# EasyEDA Pro project 雏鹰板1.eprj

# Schematic Schematic1
Board Name: Board1; Create Date: 2024-09-22; Page Name: P1; Project Name: 雏鹰板; Schematic Name: Schematic1; Update Date: 2024-09-23; Company: 嘉立创EDA; Page Size: A4; Version: V1.0
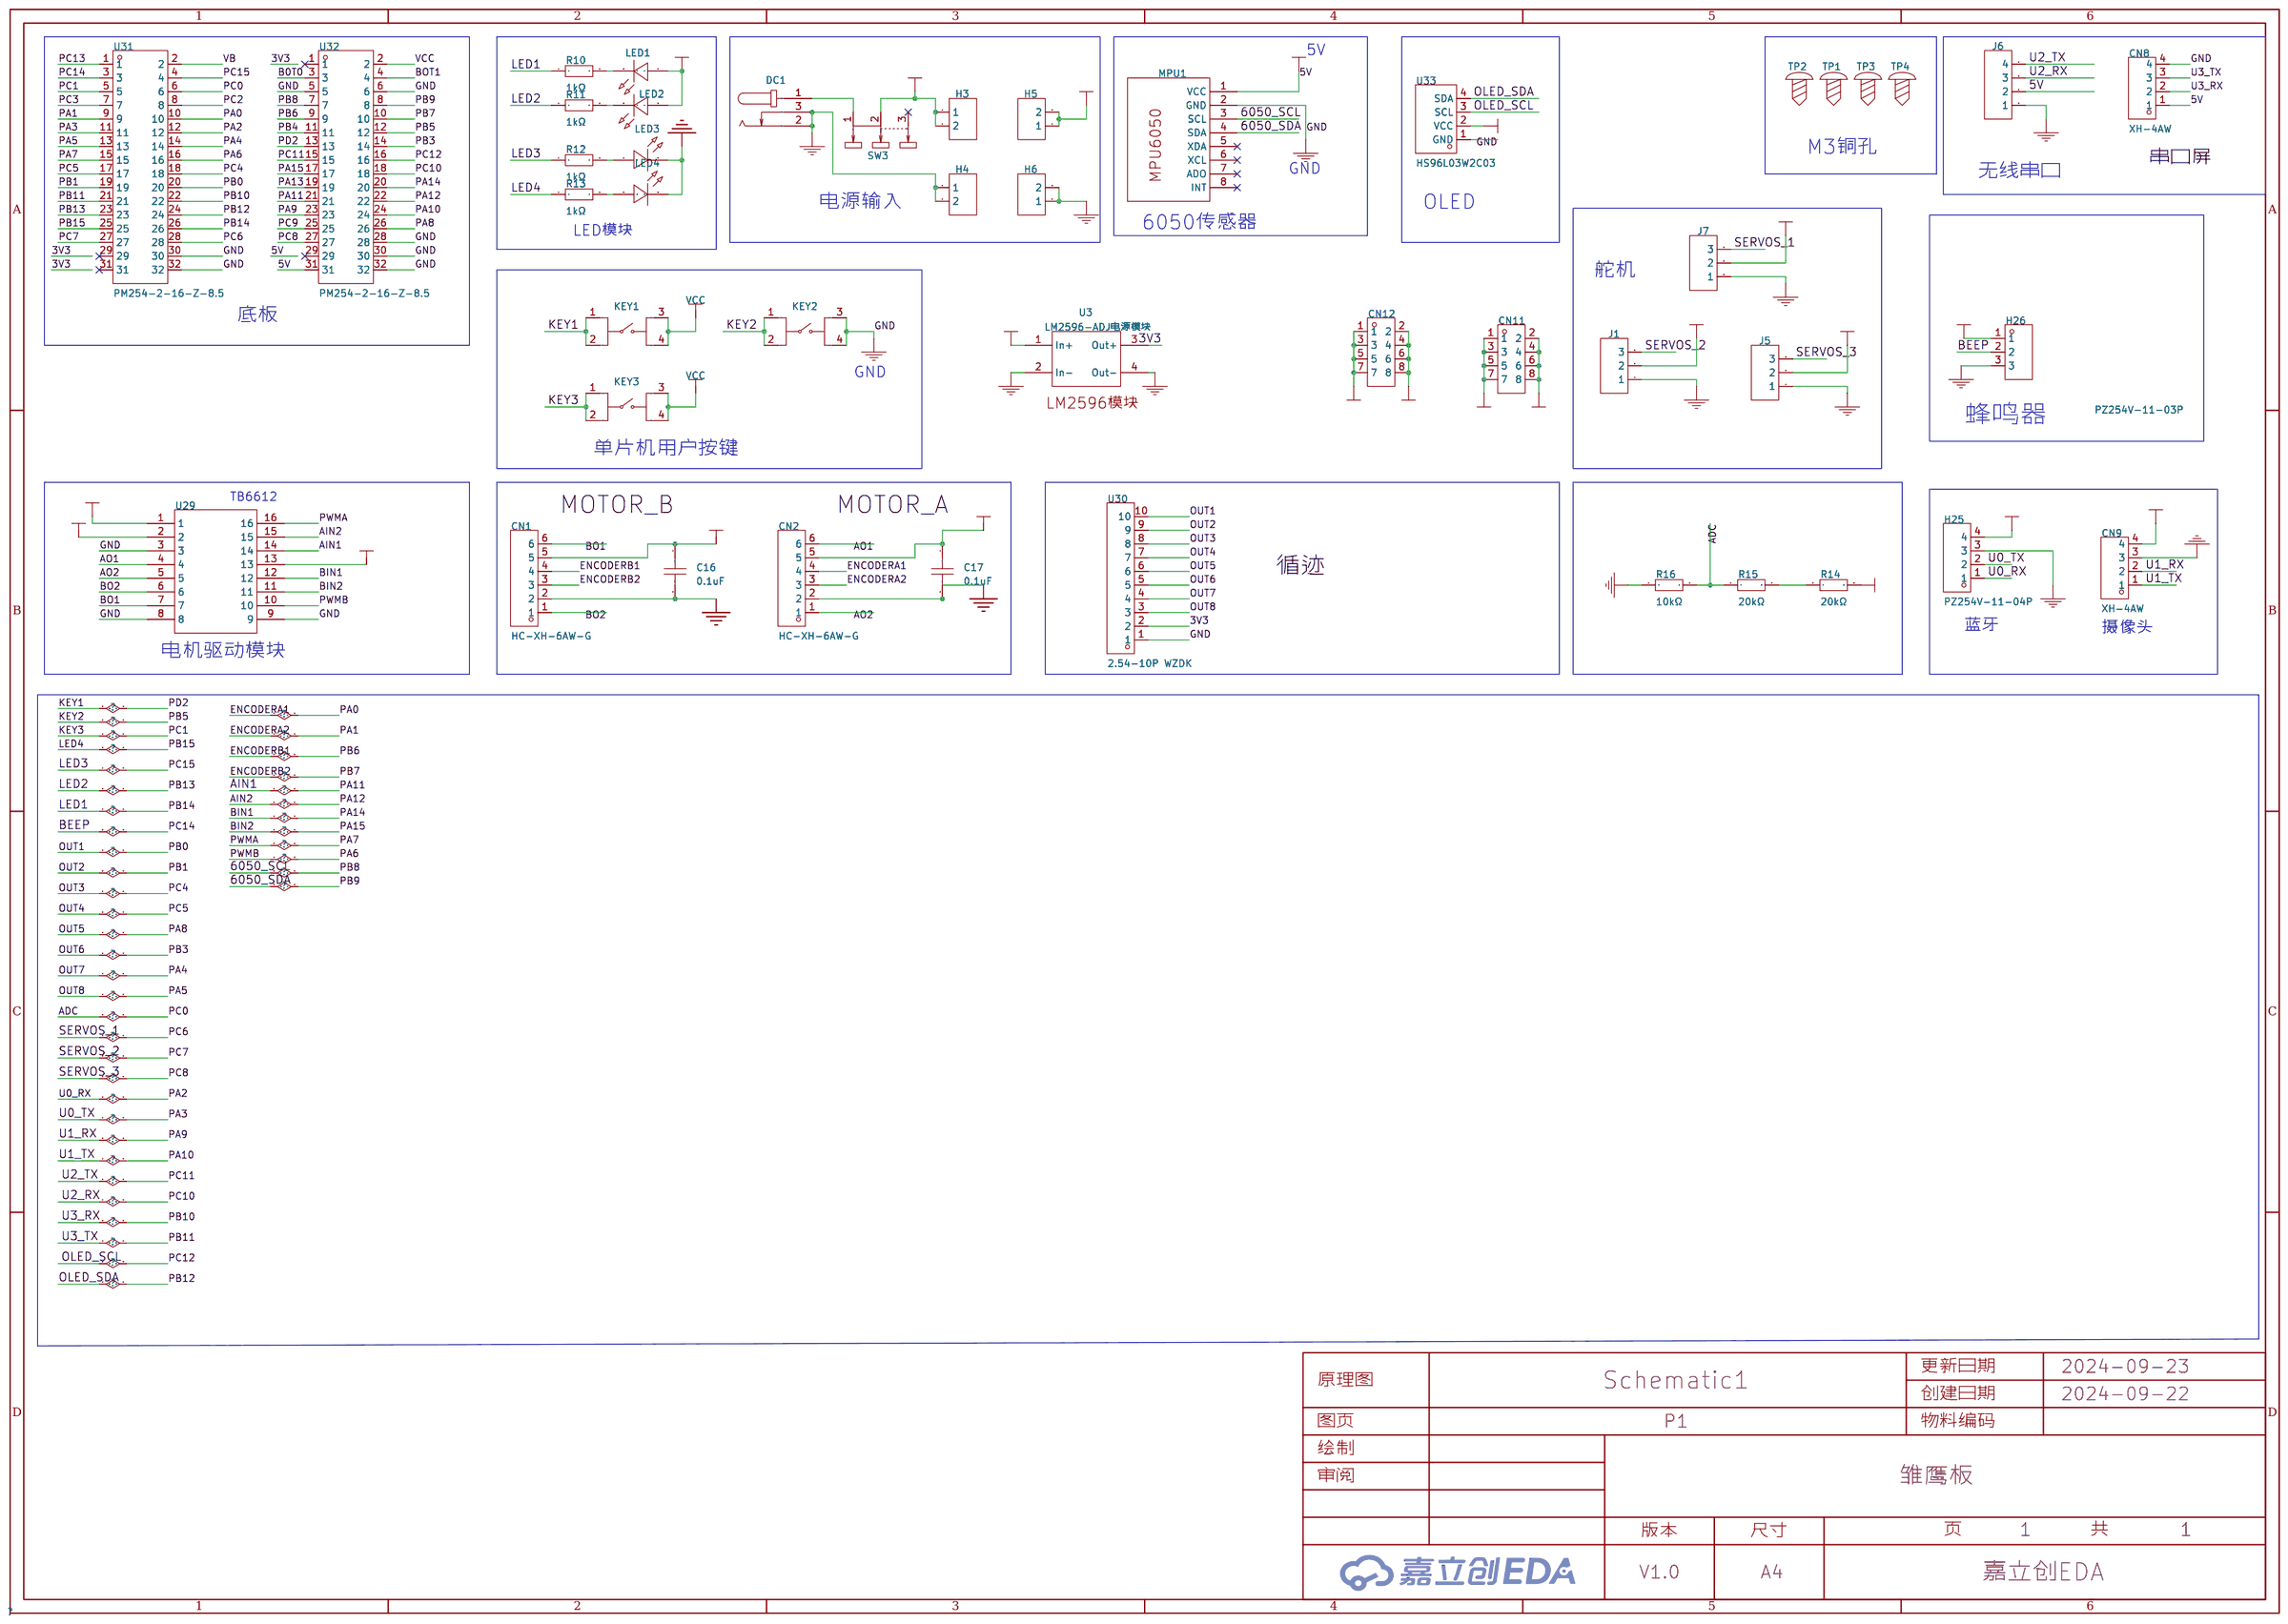
[diagram p0: schematic sheet]

## Parts
C16  0.1uF  [C0603]
C17  0.1uF  [C0603]
CN1  HC-XH-6AW-G  [CONN-TH_6P-P2.50_HC-XH-6AW-G]
CN2  HC-XH-6AW-G  [CONN-TH_6P-P2.50_HC-XH-6AW-G]
CN8  XH-4AW  [CONN-TH_XH-4AW]
CN9  XH-4AW  [CONN-TH_XH-4AW]
CN11  HC-PZ254-11.5L-2x4PZ  [HDR-TH_8P-P2.54-V-M-R2-C4-S2.54]
CN12  HC-PZ254-11.5L-2x4PZ  [HDR-TH_8P-P2.54-V-M-R2-C4-S2.54]
DC1  DC005_C431533  [DC-IN-TH_DC005]
H3  HDR-F-2.54_1x2  [HDR-F-2.54_1X2]
H4  HDR-F-2.54_1x2  [HDR-F-2.54_1X2]
H5  HDR-F-2.54_1x2  [HDR-F-2.54_1X2]
H6  HDR-F-2.54_1x2  [HDR-F-2.54_1X2]
H25  PZ254V-11-04P  [HDR-TH_4P-P2.54-V-M]
H26  PZ254V-11-03P  [HDR-TH_3P-P2.54-V-M]
J1  HDR-M-2.54_1x3  [HDR-M-2.54_1X3]
J5  HDR-M-2.54_1x3  [HDR-M-2.54_1X3]
J6  HDR-M-2.54_1x4  [HDR-M-2.54_1X4]
J7  HDR-M-2.54_1x3  [HDR-M-2.54_1X3]
KEY1  K2-6639SP-C4SC-04  [KEY-SMD_4P-L6.0-W6.0-P3.90-LS10.0]
KEY2  K2-6639SP-C4SC-04  [KEY-SMD_4P-L6.0-W6.0-P3.90-LS10.0]
KEY3  K2-6639SP-C4SC-04  [KEY-SMD_4P-L6.0-W6.0-P3.90-LS10.0]
LED1  LED-TH-5mm_R  [LED-TH_BD5.0_RED]
LED2  LED-TH-5mm_R  [LED-TH_BD5.0_RED]
LED3  LED-TH-5mm_R  [LED-TH_BD5.0_RED]
LED4  LED-TH-5mm_R  [LED-TH_BD5.0_RED]
MPU1  MPU6050 有孔(锁定丝印)  [MPU6050-丝印不可移]
R10  1kΩ  [R0603]
R11  1kΩ  [R0603]
R12  1kΩ  [R0603]
R13  1kΩ  [R0603]
R14  20kΩ  [R0805]
R15  20kΩ  [R0805]
R16  10kΩ  [R0805]
SW3  SS-12D10L5  [SW-TH_SS-12D10L5]
TP1  M3铜柱带丝印  [M3铜柱]
TP2  M3铜柱带丝印  [M3铜柱]
TP3  M3铜柱带丝印  [M3铜柱]
TP4  M3铜柱带丝印  [M3铜柱]
U3  LM2596-ADJ电源模块  [LM2596-ADJ模块]
U29  -  [COMM-TH_TB6612]
U30  2.54-10P WZDK  [HDR-TH_10P-P2.50-H-F-W7.0-N]
U31  PM254-2-16-Z-8.5  [HDR-TH_32P-P2.54-V-F-R2-C16-S2.54]
U32  PM254-2-16-Z-8.5  [HDR-TH_32P-P2.54-V-F-R2-C16-S2.54]
U33  HS96L03W2C03  [OLED-TH_L27.8-W27.2-P2.54_C9900033791]

## Library data of the parts
C16 C17 = CGA0603X5R106M350JT: 容值:10uF;精度:±20%;额定电压:35V;材质(温度系数):X5R;; LCSC Part Name: 10uF ±20% 35V; Supplier Part: C6119878; Manufacturer: HRE(芯声); Supplier Footprint: 0603; Supplier: LCSC; Tolerance: ±20%; Voltage Rated: 35V; Temperature Coefficient: X5R
CN1 CN2 = HC-XH-6AW-G: 插针结构:1x6P;间距:2.5mm;安装方式:弯插;参考系列:XH;总PIN数:6P;排数:1;每排PIN数:6;行距:-;额定电流:3A;触头材质:黄铜;触头镀层:锡;工作温度范围:-25℃~+85℃;; LCSC Part Name: 1x6P 间距:2.5mm 弯插 系列:XH; Supplier Part: C5341212; Manufacturer: HCTL(华灿天禄); Supplier Footprint: 弯插,P=2.5mm; JLCPCB Part Class: 扩展库; Datasheet: https://atta.szlcsc.com/upload/public/pdf/source/20230711/B565BAF3B11666EF6B81B3605408F2BD.pdf; Supplier: LCSC; Pins Structure: 1x6P; Pitch: 2.5mm; Mounting Style: 弯插; Reference Series: XH; Number of Pins: 6P; Number of Rows: 1; Number of PINs Per Row: 6; Current Rating (Max): 3A; Contact Material: 黄铜; Contact Plating: 锡; Operating Temperature Range: -25℃~+85℃
CN8 CN9 = XH-4AW: 插针结构:1x4P;间距:2.54mm;安装方式:弯插;参考系列:XH;总PIN数:4P;排数:1;每排PIN数:4;行距:-;额定电流:3A;触头材质:黄铜;触头镀层:锡;工作温度范围:-25℃~+85℃;; LCSC Part Name: 1x4P 间距:2.54mm 弯插 系列:XH; Supplier Part: C2908613; Manufacturer: HCTL(华灿天禄); Supplier Footprint: 弯插,P=2.5mm; JLCPCB Part Class: 扩展库; Datasheet: https://atta.szlcsc.com/upload/public/pdf/source/20230711/B565BAF3B11666EF6B81B3605408F2BD.pdf; Supplier: LCSC; Pins Structure: 1x4P; Pitch: 2.54mm; Mounting Style: 弯插; Reference Series: XH; Number of Pins: 4P; Number of Rows: 1; Number of PINs Per Row: 4; Current Rating (Max): 3A; Contact Material: 黄铜; Contact Plating: 锡; Operating Temperature Range: -25℃~+85℃
CN11 CN12 = HC-PZ254-11.5L-2x4PZ: 插针结构：2x4P间距：2.54mm行距：2.54mm圆针/方针:方针安装类型:直插排数:双排总PIN位数:8P额定电流:3A额定电压:1000V配合针长度:6mm塑高:2.5mm端接针长度:3mm触头材质:黄铜触头镀层:金工作温度范围:-40℃~+105℃焊接温度(最大值):260℃@5s颜色:黑色; LCSC Part Name: 间距2.54mm 2x4Pin 直插 H2.5 L11.5; Supplier Part: C27985200; Manufacturer: HC(虹成电子); Supplier Footprint: 插件,P=2.54mm; Datasheet: https://atta.szlcsc.com/upload/public/pdf/source/20240710/7243C4D67459C8BB080740A4C04FBFB8.pdf; Supplier: LCSC
DC1 = DC005_C431533: Supplier: LCSC; Supplier Part: C431533; Manufacturer: SHOU HAN; Manufacturer Part: DC005; JLCPCB Part Class: Extended Part
H3-H6 = HDR-F-2.54_1x2: Supplier Part: C49661; Supplier: LCSC
H25 = PZ254V-11-04P: 插针结构:1x4P;间距:2.54mm;行距:-;圆针/方针:方针;安装类型:直插;排数:单排;总PIN位数:4P;额定电流:3A;额定电压:250V;配合针长度:6mm;塑高:2.5mm;端接针长度:3mm;触头材质:-;工作温度范围:-40℃~+105℃;颜色:黑色;; LCSC Part Name: 间距:2.54mm 1x4P 直插 方针; Supplier Part: C2691448; Manufacturer: XFCN(兴飞); Supplier Footprint: 插件,P=2.54mm; JLCPCB Part Class: 扩展库; Datasheet: https://atta.szlcsc.com/upload/public/pdf/source/20200309/C492403_F9F19131791D08044AD4F84F8E751A34.pdf; Supplier: LCSC; Pin Structure: 1x4P; Pitch: 2.54mm; Circluar Pins/Square Pins: 方针; Mounting Type: 直插; Number of Rows: 单排; Number of Pins: 4P; Current Rating (Max): 3A; Voltage Rating (Max): 250V; Length of Mating Pin: 6mm; Insulation Height: 2.5mm; Length of End Connection Pin: 3mm; Operating Temperature Range: -40℃~+105℃; Color: 黑色
H26 = PZ254V-11-03P: 插针结构:1x3P;间距:2.54mm;行距:-;圆针/方针:方针;安装类型:直插;排数:单排;总PIN位数:3P;额定电流:3A;额定电压:250V;配合针长度:6mm;塑高:2.5mm;端接针长度:3mm;工作温度范围:-40℃~+105℃;颜色:黑色;; LCSC Part Name: 间距:2.54mm 1x3P 直插 方针; Supplier Part: C2937625; Manufacturer: XFCN(兴飞); Supplier Footprint: 插件,P=2.54mm; JLCPCB Part Class: 扩展库; Datasheet: https://atta.szlcsc.com/upload/public/pdf/source/20200309/C492402_8335C3D49C4E4C618838D59BB1D024C1.pdf; Supplier: LCSC; Pin Structure: 1x3P; Pitch: 2.54mm; Circluar Pins/Square Pins: 方针; Mounting Type: 直插; Number of Rows: 单排; Number of Pins: 3P; Current Rating (Max): 3A; Voltage Rating (Max): 250V; Length of Mating Pin: 6mm; Insulation Height: 2.5mm; Length of End Connection Pin: 3mm; Operating Temperature Range: -40℃~+105℃; Color: 黑色
J1 J5 J7 = HDR-M-2.54_1x3: Supplier Part: C180248; Supplier: LCSC
J6 = HDR-M-2.54_1x4: Supplier Part: C124378; Supplier: LCSC
KEY1-KEY3 = K2-6639SP-C4SC-04: Supplier: LCSC; Manufacturer: HRO; Supplier Part: C83206; JLCPCB Part Class: Extended Part
LED1-LED4 = LED-TH-5mm_R: Manufacturer: EVERLIGHT(台湾亿光); Manufacturer Part: 333-2SURD/S530-A3; Supplier Part: C87271; Supplier: LCSC
MPU1 = MPU6050 有孔(锁定丝印)
R10-R13 = RC0603FR-071KL: 电阻类型:厚膜电阻;阻值:1kΩ;精度:±1%;功率:100mW;最大工作电压:75V;温度系数:±100ppm/℃;; LCSC Part Name: 厚膜电阻 1kΩ ±1% 100mW; Supplier Part: C22548; Manufacturer: YAGEO(国巨); Supplier Footprint: 0603; JLCPCB Part Class: 扩展库; Datasheet: https://atta.szlcsc.com/upload/public/pdf/source/20180316/70C0E2BDAE7FCC62C531A5A58D202EE1.pdf; Supplier: LCSC; Type: 厚膜电阻; Tolerance: ±1%; Power(Watts): 100mW; Overload Voltage (Max): 75V; Temperature Coefficient: ±100ppm/℃; Operating Temperature Range: -55℃~+155℃
R14 R15 = RC0805JR-0720KL: 电阻类型:厚膜电阻;阻值:20kΩ;精度:±5%;功率:125mW;最大工作电压:150V;温度系数:±100ppm/℃;; LCSC Part Name: 厚膜电阻 20kΩ ±5% 125mW; Supplier Part: C114233; Manufacturer: YAGEO(国巨); Supplier Footprint: 0805; JLCPCB Part Class: 扩展库; Datasheet: https://atta.szlcsc.com/upload/public/pdf/source/20170705/1499242704799.pdf; Supplier: LCSC; Type: 厚膜电阻; Tolerance: ±5%; Power(Watts): 125mW; Overload Voltage (Max): 150V; Temperature Coefficient: ±100ppm/℃; Operating Temperature Range: -55℃~+155℃
R16 = RT0805BRD0710KL: 电阻类型:薄膜电阻;阻值:10kΩ;精度:±0.1%;功率:125mW;最大工作电压:150V;温度系数:±25ppm/℃;; LCSC Part Name: 薄膜电阻 10kΩ ±0.1% 125mW; Supplier Part: C110775; Manufacturer: YAGEO(国巨); Supplier Footprint: 0805; JLCPCB Part Class: 扩展库; Datasheet: https://atta.szlcsc.com/upload/public/pdf/source/20171026/C133380_15089840010201058857.pdf; Supplier: LCSC; Type: 薄膜电阻; Tolerance: ±0.1%; Power(Watts): 125mW; Overload Voltage (Max): 150V; Temperature Coefficient: ±25ppm/℃; Operating Temperature Range: -55℃~+155℃
SW3 = SS-12D10L5: Supplier: LCSC; Supplier Part: C319012; Manufacturer: XKB Enterprise; JLCPCB Part Class: Extended Part
TP1-TP4 = M3铜柱带丝印
U3 = LM2596-ADJ电源模块
U29 = TB6612引脚插入型器件
U30 = 2.54-10P WZDK: 插针结构:1x10P;间距:2.5mm;安装方式:弯插;参考系列:XH;总PIN数:10P;排数:1;每排PIN数:10;额定电流:3A;触头材质:黄铜;触头镀层:锡;工作温度范围:-25℃~+85℃;; LCSC Part Name: 1x10P 间距:2.5mm 弯插 系列:XH 白色; Supplier Part: C18185679; Manufacturer: SHOU HAN(首韩); Supplier Footprint: 弯插,P=2.5mm; JLCPCB Part Class: 扩展库; Datasheet: https://atta.szlcsc.com/upload/public/pdf/source/20230919/4BD47710B65E65967C81E321361D4DDB.pdf; Supplier: LCSC; Pins Structure: 1x10P; Pitch: 2.5mm; Mounting Style: 弯插; Reference Series: XH; Number of Pins: 10P; Number of Rows: 1; Number of PINs Per Row: 10; Current Rating (Max): 3A; Contact Material: 黄铜; Contact Plating: 锡; Operating Temperature Range: -25℃~+85℃
U31 U32 = PM254-2-16-Z-8.5: 插孔结构:2x16P;间距:2.54mm;行距:2.54mm;圆孔/方孔:方孔;安装类型:直插;排数:双排;总孔位数:32P;额定电流:3A;额定电压:-;插孔方向:顶部;塑高:8.5mm;触头材质:铜合金;工作温度范围:-40℃~+105℃;焊接温度(最大值):260℃@5S;; LCSC Part Name: 2x16P 间距:2.54mm 直插; Supplier Part: C2897417; Manufacturer: HCTL(华灿天禄); Supplier Footprint: 插件,P=2.54mm; JLCPCB Part Class: 扩展库; Datasheet: https://atta.szlcsc.com/upload/public/pdf/source/20230609/3D36CA2C1BFC9FD1C3F709AD9DFEB9C2.pdf; Supplier: LCSC; Holes Structure: 2x16P; Pitch: 2.54mm; Row Spacing: 2.54mm; Circular Hole / Square Hole: 方孔; Mounting Type: 直插; Number of Rows: 双排; Number of Holes: 32P; Current Rating (Max): 3A; Holes Direction: 顶部; Insulation Height: 8.5mm; Contact Material: 铜合金; Operating Temperature Range: -40℃~+105℃; Soldering Temperature(Max): 260℃@5S
U33 = HS96L03W2C03: 主控芯片:SSD1315;接口类型:I2C;尺寸(inch):0.96;像素分辨率:128x64;; LCSC Part Name: 0.96寸OLED显示屏窄白光IIC; Supplier Part: C5248080; Manufacturer: HS(汉昇); JLCPCB Part Class: 扩展库; Datasheet: https://atta.szlcsc.com/upload/public/pdf/source/20230627/763D01F79A90007632F098068C7C8AD9.pdf; Supplier: LCSC; Main Control Chip: SSD1315; Interface Type: I2C; Size: 0.96; Pixel Resolution: 128x64; Operating Temperature: -40℃~+70℃

## Nets
3V3: CN12.1 CN12.3 CN12.5 CN12.7 J1.2 J5.2 J7.2 LED1.1 LED2.1 U3.3(Out+) U30.2
5V: C16.1 C17.1 CN1.5 CN2.5 CN8.1 CN9.4 CN11.1 CN11.3 CN11.5 CN11.7 H5.1 H5.2 H25.4 H26.1 J6.2 MPU1.1(VCC) U29.2 U29.13 U32.31 U33.2(VCC)
GND: C16.2 C17.2 CN1.2 CN2.2 CN8.4 CN9.3 CN12.2 CN12.4 CN12.6 CN12.8 DC1.2 DC1.3 H4.1 H4.2 H6.1 H6.2 H25.3 H26.3 J1.1 J5.1 J6.1 J7.1 KEY2.3 KEY2.4 LED3.2 LED4.2 MPU1.2(GND) R16.1 U3.2(In-) U3.4(Out-) U29.3 U29.8 U29.9 U30.1 U31.30 U31.32 U32.5 U32.6 U32.28 U32.30 U32.32 U33.1(GND)
VBAT_IN: CN11.2 CN11.4 CN11.6 CN11.8 H3.1 H3.2 R14.2 SW3.2 U3.1(In+) U29.1
VCC: KEY1.3 KEY1.4 KEY3.3 KEY3.4 U32.2
6050_SCL: MPU1.3(SCL) U32.7
6050_SDA: MPU1.4(SDA) U32.8
ADC: R15.1 R16.2 U31.6
AIN1: U29.14 U32.21
AIN2: U29.15 U32.22
AO1: CN2.6 U29.4
AO2: CN2.1 U29.5
B0T0: U32.3
BEEP: H26.2 U31.3
BIN1: U29.12 U32.20
BIN2: U29.11 U32.17
BO1: CN1.6 U29.7
BO2: CN1.1 U29.6
BOT1: U32.4
ENCODERA1: CN2.4 U31.10
ENCODERA2: CN2.3 U31.9
ENCODERB1: CN1.4 U32.9
ENCODERB2: CN1.3 U32.10
KEY1: KEY1.1 KEY1.2 U32.13
KEY2: KEY2.1 KEY2.2 U32.12
KEY3: KEY3.1 KEY3.2 U31.5
LED1: R10.1 U31.26
LED2: R11.1 U31.23
LED3: R12.1 U31.4
LED4: R13.1 U31.25
OLED_SCL: U32.16 U33.3(SCL)
OLED_SDA: U31.24 U33.4(SDA)
OUT1: U30.10 U31.20
OUT2: U30.9 U31.19
OUT3: U30.8 U31.18
OUT4: U30.7 U31.17
OUT5: U30.6 U32.26
OUT6: U30.5 U32.14
OUT7: U30.4 U31.14
OUT8: U30.3 U31.13
PA2: H25.1 U31.12
PA3: H25.2 U31.11
PA6: U29.10 U31.16
PA7: U29.16 U31.15
PA9: CN9.2 U32.23
PA10: CN9.1 U32.24
PA13: U32.19
PB4: U32.11
PB10: CN8.2 U31.22
PB11: CN8.3 U31.21
PC2: U31.8
PC3: U31.7
PC6: J7.3 U31.28
PC7: J1.3 U31.27
PC8: J5.3 U32.27
PC9: U32.25
PC10: J6.3 U32.18
PC11: J6.4 U32.15
PC13: U31.1
VB: U31.2
$1N2595: LED2.2 R11.2
$1N2596: LED1.2 R10.2
$1N2601: LED3.1 R12.2
$1N2602: LED4.1 R13.2
$1N3090: DC1.1 SW3.1
$1N6234: R14.1 R15.2

Not connected (* = marked no-connect by the designer): MPU1 5(XDA)* 6(XCL)* 7(ADO)* 8(INT)*; SW3 3*; U31 29* 31*; U32 1* 29*

## Notes on the sheet
- 5V
- M3铜孔
- GND
- 串口屏
- 无线串口
- 电源输入
- OLED
- LED模块
- 6050传感器
- 舵机
- 底板
- GND
- 蜂鸣器
- 单片机用户按键
- TB6612
- MOTOR_B
- MOTOR_A
- 循迹
- 蓝牙
- 摄像头
- 电机驱动模块

# Board PCB1
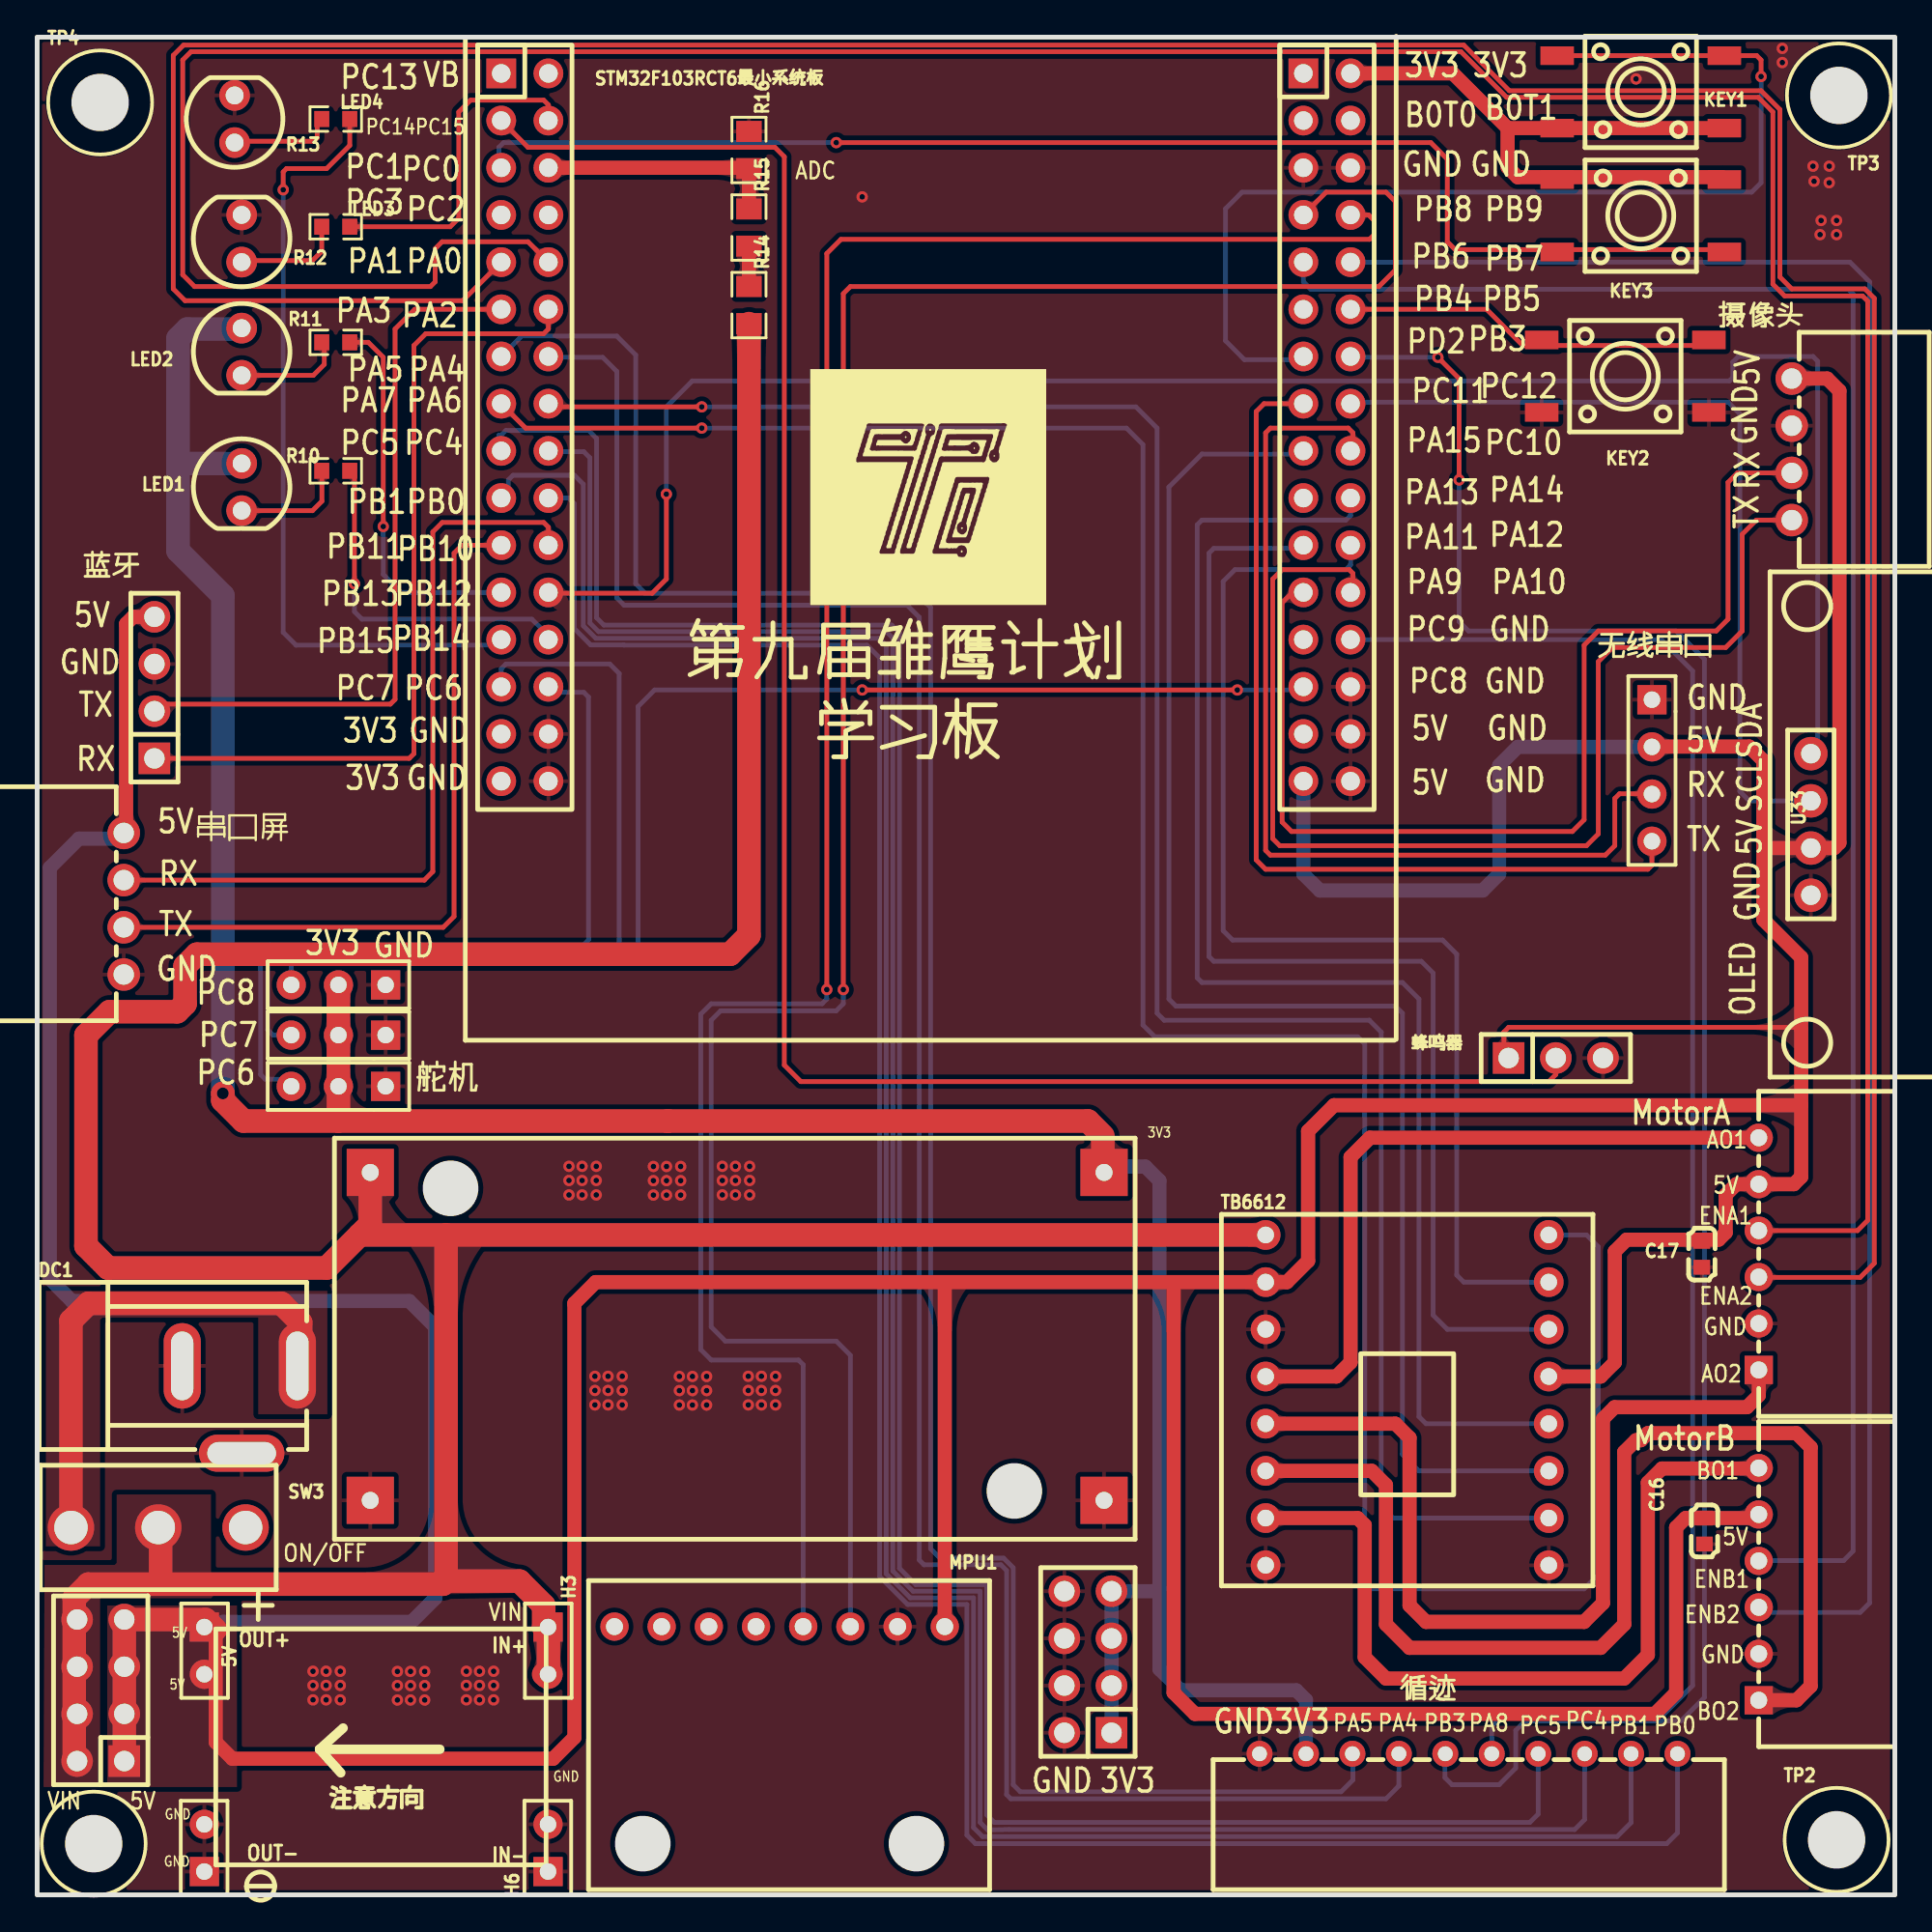
[diagram p1: board, top side]
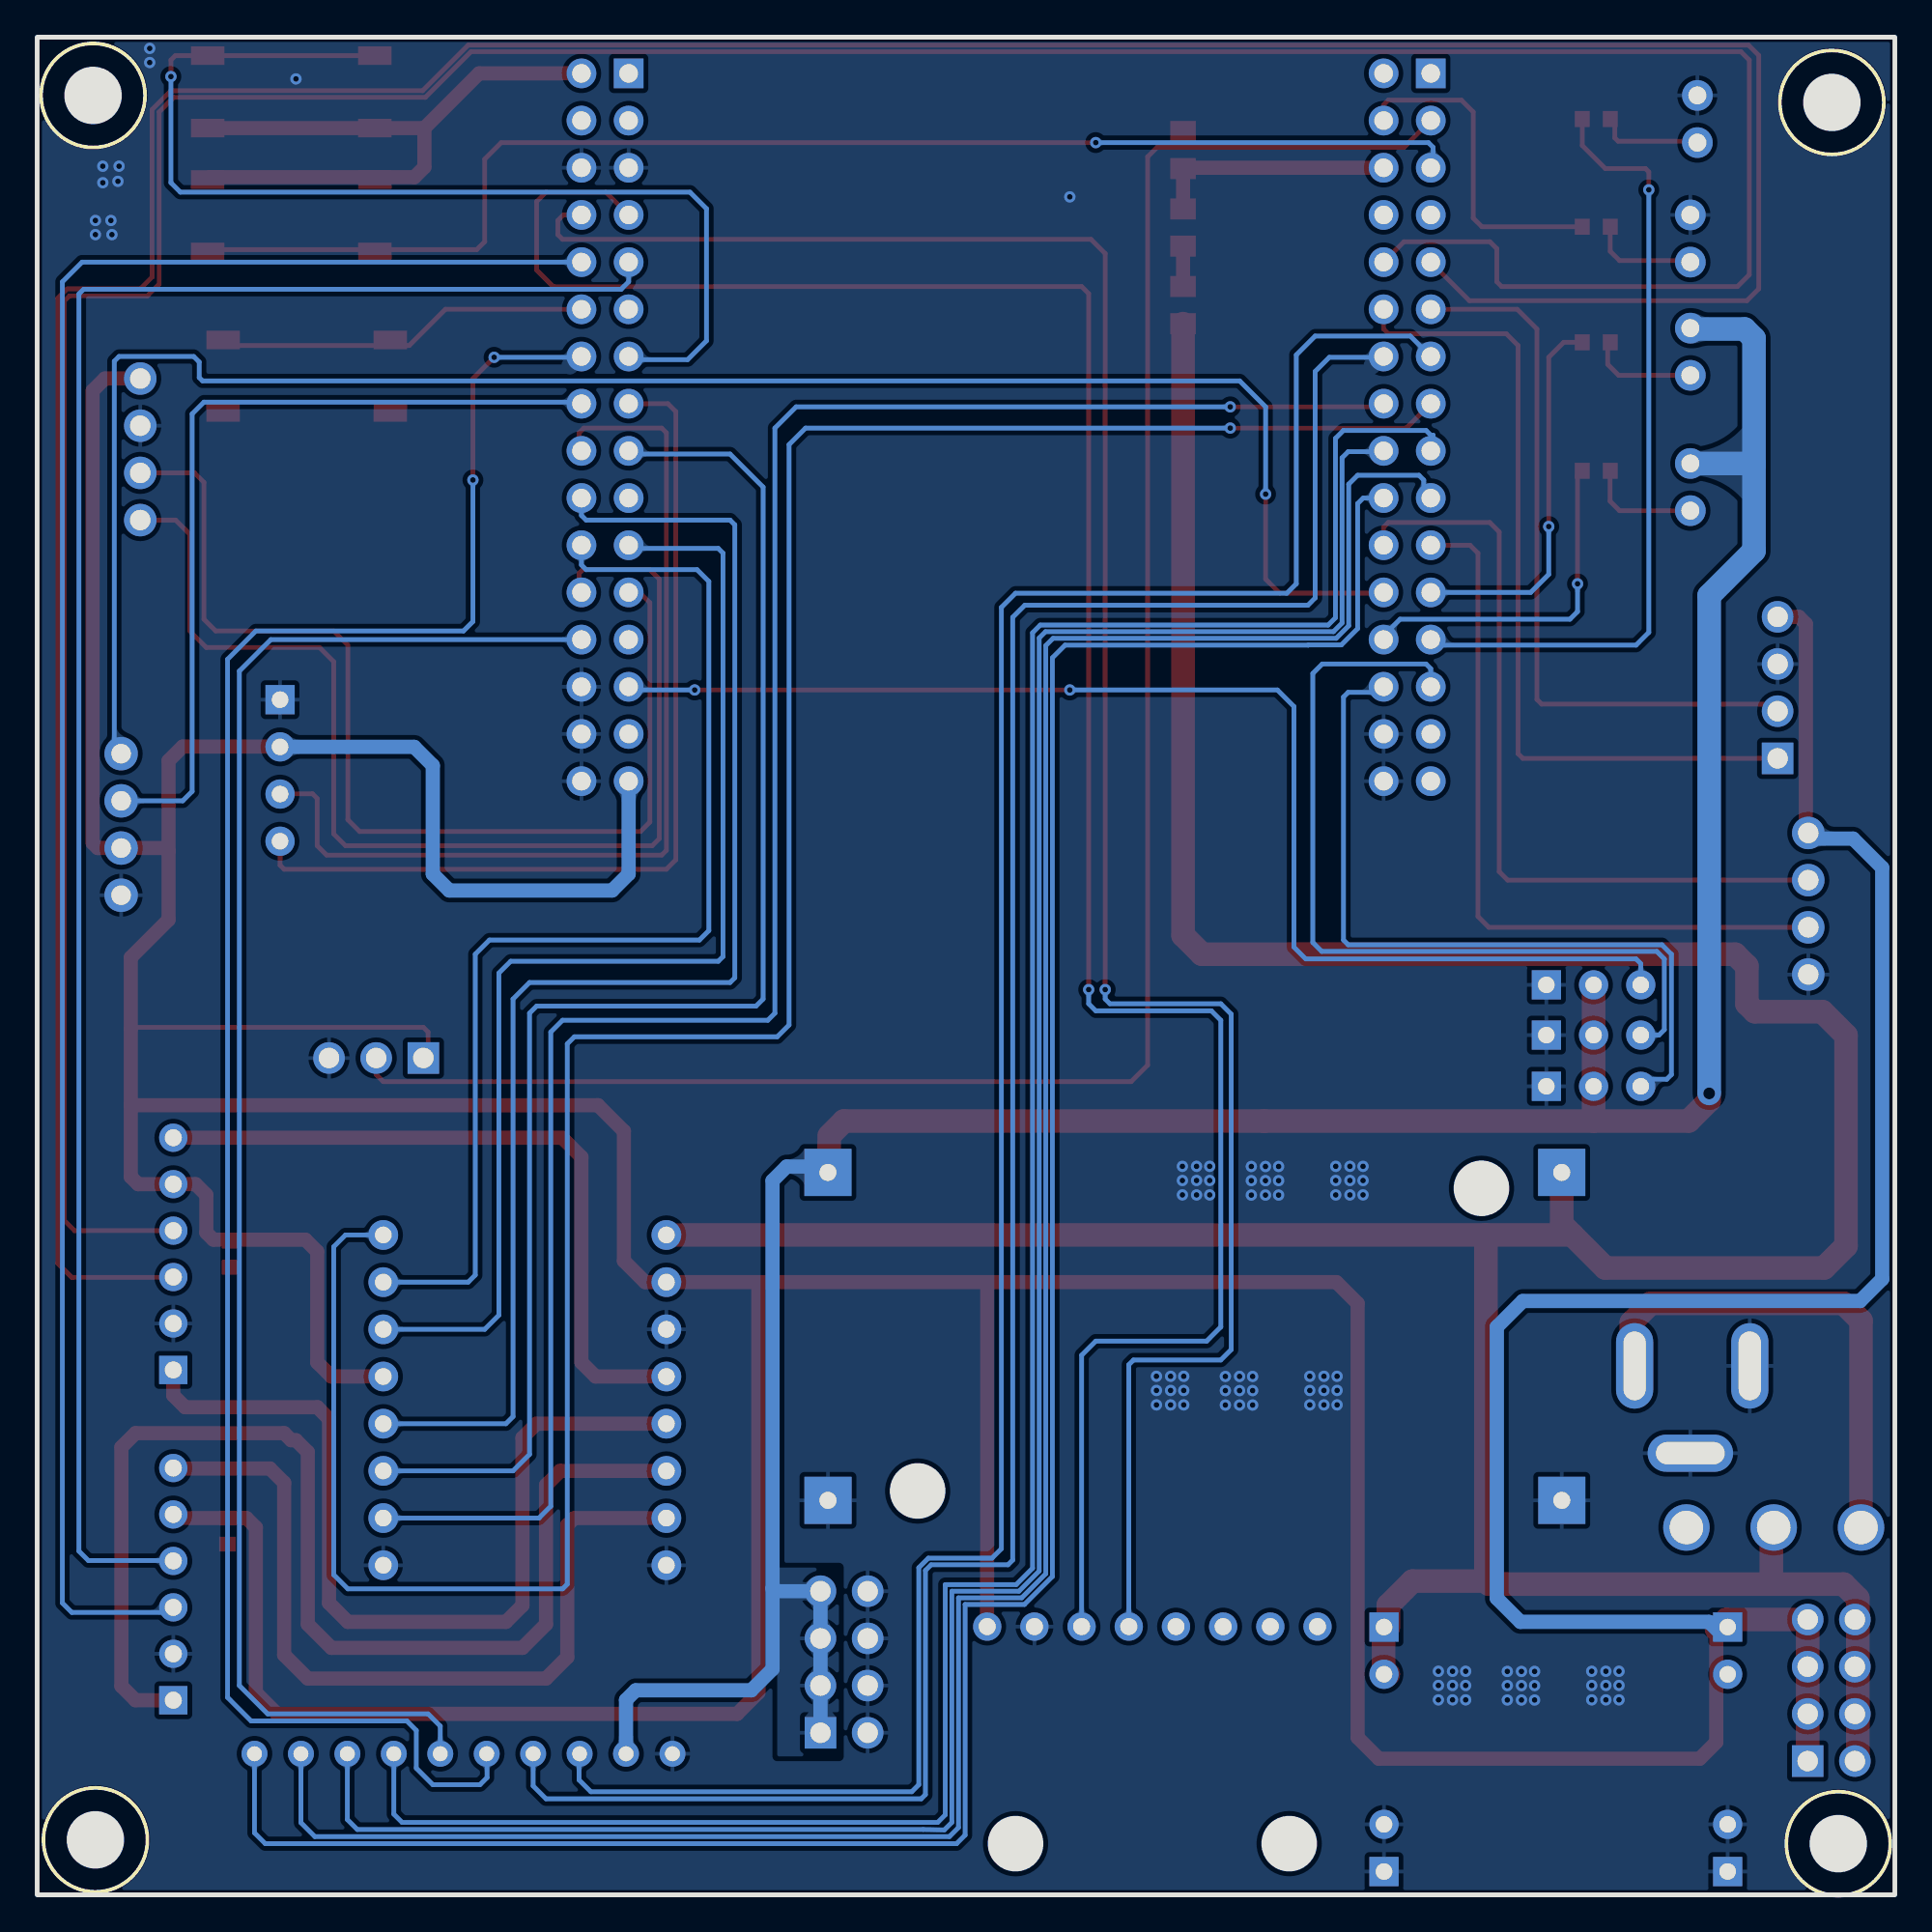
[diagram p2: board, bottom side, seen from below]

Outline 100 x 100 mm; copper layers: Top Layer, Bottom Layer. Coordinates in mm from the lower left corner of the outline.
Outline path: rectangle 0,100 100,0
Stack: Top Layer 0.035mm / Dielectric1 1.51mm FR4 er 4.5 / Bottom Layer 0.035mm

## Design rules (mm)
template: JLCPCB Capability(Two Layers Board)
spacing copperThickness1oz (default): track to track 0.102, other pairs 0.152 to 0.3
spacing copperThickness2oz: track to track 0.203, other pairs 0.152 to 0.3
track width copperThickness1oz (default): min 0.127, default 0.254, max 2.54
track width copperThickness2oz: min 0.203, default 0.254, max 2.54
differential pair differentialPair (default): width min 0.127, default 0.254, max 2.54; gap min 0.152, default 0.152
via viaSize (default): diameter min 0.5, default 0.61, max 10; hole min 0.3, default 0.305, max 6.3

## Placement (name value [footprint] x y rotation side)
5V  HDR-F-2.54_1x2  [HDR-F-2.54_1X2]  9 13.14 270 top
C16  0.1uF  [C0603]  89.75 19.58 270 top
C17  0.1uF  [C0603]  89.61 34.48 270 top
CN1  HC-XH-6AW-G  [CONN-TH_6P-P2.50_HC-XH-6AW-G]  92.67 16.73 90 top
CN2  HC-XH-6AW-G  [CONN-TH_6P-P2.50_HC-XH-6AW-G]  92.67 34.51 90 top
CN8  XH-4AW  [CONN-TH_XH-4AW]  4.66 53.35 270 top
CN11  HC-PZ254-11.5L-2x4PZ  [HDR-TH_8P-P2.54-V-M-R2-C4-S2.54]  3.42 11.01 90 top
CN12  HC-PZ254-11.5L-2x4PZ  [HDR-TH_8P-P2.54-V-M-R2-C4-S2.54]  56.56 12.53 90 top
DC1  DC005_C431533  [DC-IN-TH_DC005]  10.91 26.12 0 top
H3  HDR-F-2.54_1x2  [HDR-F-2.54_1X2]  27.5 13.14 270 top
H4  HDR-F-2.54_1x2  [HDR-F-2.54_1X2]  9 2.52 90 top
H6  HDR-F-2.54_1x2  [HDR-F-2.54_1X2]  27.5 2.53 90 top
J1  HDR-M-2.54_1x3  [HDR-M-2.54_1X3]  16.22 46.28 180 top
J5  HDR-M-2.54_1x3  [HDR-M-2.54_1X3]  16.22 48.98 180 top
J7  HDR-M-2.54_1x3  [HDR-M-2.54_1X3]  16.22 43.52 180 top
KEY1  K2-6639SP-C4SC-04  [KEY-SMD_4P-L6.0-W6.0-P3.90-LS10.0]  86.32 97.05 0 top
KEY2  K2-6639SP-C4SC-04  [KEY-SMD_4P-L6.0-W6.0-P3.90-LS10.0]  85.49 81.75 0 top
KEY3  K2-6639SP-C4SC-04  [KEY-SMD_4P-L6.0-W6.0-P3.90-LS10.0]  86.32 90.39 180 top
LED1  LED-TH-5mm_R  [LED-TH_BD5.0_RED]  11.01 75.78 0 top
LED2  LED-TH-5mm_R  [LED-TH_BD5.0_RED]  11.01 83.07 0 top
LED3  LED-TH-5mm_R  [LED-TH_BD5.0_RED]  11.01 89.16 180 top
LED4  LED-TH-5mm_R  [LED-TH_BD5.0_RED]  10.63 95.59 180 top
MPU1  MPU6050 有孔(锁定丝印)  [MPU6050-丝印不可移]  48.86 14.44 270 top
R10  1kΩ  [R0603]  16.07 76.66 180 top
R11  1kΩ  [R0603]  16.07 83.57 180 top
R12  1kΩ  [R0603]  16.07 89.8 180 top
R13  1kΩ  [R0603]  16.07 95.59 180 top
R14  20kΩ  [R0805]  38.32 85.58 270 top
R15  20kΩ  [R0805]  38.32 89.75 270 top
R16  10kΩ  [R0805]  38.32 93.93 270 top
STM32F103RCT6最小系统板  PM254-2-16-Z-8.5  [HDR-TH_32P-P2.54-V-F-R2-C16-S2.54]  26.25 79 270 top
SW3  SS-12D10L5  [SW-TH_SS-12D10L5]  6.52 19.77 0 top
TB6612  -  [COMM-TH_TB6612]  73.75 26.63 0 top
TP1  M3铜柱带丝印  [M3铜柱]  3.04 2.76 0 top
TP2  M3铜柱带丝印  [M3铜柱]  96.86 2.96 0 top
TP3  M3铜柱带丝印  [M3铜柱]  96.99 96.86 0 top
TP4  M3铜柱带丝印  [M3铜柱]  3.39 96.49 0 top
U3  LM2596-ADJ电源模块  [LM2596-ADJ模块]  37.68 30.06 0 top
U32  PM254-2-16-Z-8.5  [HDR-TH_32P-P2.54-V-F-R2-C16-S2.54]  69.43 79 270 top
U33  HS96L03W2C03  [OLED-TH_L27.8-W27.2-P2.54_C9900033791]  95.48 57.62 90 top
循迹  2.54-10P WZDK  [HDR-TH_10P-P2.50-H-F-W7.0-N]  77.05 7.59 0 top
摄像头  XH-4AW  [CONN-TH_XH-4AW]  94.45 77.81 90 top
无线串口  HDR-M-2.54_1x4  [HDR-M-2.54_1X4]  86.92 60.53 270 top
蓝牙  PZ254V-11-04P  [HDR-TH_4P-P2.54-V-M]  6.31 64.99 90 top
蜂鸣器  PZ254V-11-03P  [HDR-TH_3P-P2.54-V-M]  81.75 45.05 0 top

## Footprints (pads in the part's own frame, mm; a bottom-side part is the same pattern mirrored in y, then rotated)
C0603
  rect 0.8x0.9 smd: 1(-0.7,0) 2(0.7,0)
COMM-TH_TB6612
  round 1.6 hole 0.9: 1(-7.62,8.89) 2(-7.62,6.35) 3(-7.62,3.81) 4(-7.62,1.27) 5(-7.62,-1.27) 6(-7.62,-3.81) 7(-7.62,-6.35) 8(-7.62,-8.89) 9(7.62,-8.89) 10(7.62,-6.35) 11(7.62,-3.81) 12(7.62,-1.27) 13(7.62,1.27) 14(7.62,3.81) 15(7.62,6.35) 16(7.62,8.89)
CONN-TH_6P-P2.50_HC-XH-6AW-G
  rect 1.524x1.524 hole 0.914: 1(-6.25,0)
  round 1.524 hole 0.914: 2(-3.75,0) 3(-1.25,0) 4(1.25,0) 5(3.75,0) 6(6.25,0)
CONN-TH_XH-4AW
  round 1.75 hole 1.1: 1(-3.81,0) 2(-1.27,0) 3(1.27,0) 4(3.81,0)
DC-IN-TH_DC005
  oval 2x4.6 hole 1.2x3.7: 1(3.1,2.35) 2(-3.1,2.35)
  oval 4.6x2 hole 3.7x1.2: 3(0.1,-2.35)
HDR-F-2.54_1X2
  rect 1.575x1.575 hole 0.889: 1(-1.27,0)
  round 1.575 hole 0.889: 2(1.27,0)
HDR-M-2.54_1X3
  rect 1.575x1.575 hole 0.889: 1(-2.54,0)
  round 1.575 hole 0.889: 2(0,0) 3(2.54,0)
HDR-M-2.54_1X4
  rect 1.575x1.575 hole 0.889: 1(-3.81,0)
  round 1.575 hole 0.889: 2(-1.27,0) 3(1.27,0) 4(3.81,0)
HDR-TH_3P-P2.54-V-M
  rect 1.7x1.7 hole 1.1: 1(-2.54,0)
  round 1.7 hole 1.1: 2(0,0) 3(2.54,0)
HDR-TH_4P-P2.54-V-M
  rect 1.7x1.7 hole 1.1: 1(-3.81,0)
  round 1.7 hole 1.1: 2(-1.27,0) 3(1.27,0) 4(3.81,0)
HDR-TH_8P-P2.54-V-M-R2-C4-S2.54
  rect 1.7x1.7 hole 1.1: 1(-3.81,-1.27)
  round 1.7 hole 1.1: 2(-3.81,1.27) 3(-1.27,-1.27) 4(-1.27,1.27) 5(1.27,-1.27) 6(1.27,1.27) 7(3.81,-1.27) 8(3.81,1.27)
HDR-TH_10P-P2.50-H-F-W7.0-N
  round 1.4 hole 0.8: 1(-11.25,0) 2(-8.75,0) 3(-6.25,0) 4(-3.75,0) 5(-1.25,0) 6(1.25,0) 7(3.75,0) 8(6.25,0) 9(8.75,0) 10(11.25,0)
HDR-TH_32P-P2.54-V-F-R2-C16-S2.54
  rect 1.6x1.6 hole 1: 1(-19.05,-1.27)
  round 1.6 hole 1: 2(-19.05,1.27) 3(-16.51,-1.27) 4(-16.51,1.27) 5(-13.97,-1.27) 6(-13.97,1.27) 7(-11.43,-1.27) 8(-11.43,1.27) 9(-8.89,-1.27) 10(-8.89,1.27) 11(-6.35,-1.27) 12(-6.35,1.27) 13(-3.81,-1.27) 14(-3.81,1.27) 15(-1.27,-1.27) 16(-1.27,1.27) 17(1.27,-1.27) 18(1.27,1.27) 19(3.81,-1.27) 20(3.81,1.27) 21(6.35,-1.27) 22(6.35,1.27) 23(8.89,-1.27) 24(8.89,1.27) 25(11.43,-1.27) 26(11.43,1.27) 27(13.97,-1.27) 28(13.97,1.27) 29(16.51,-1.27) 30(16.51,1.27) 31(19.05,-1.27) 32(19.05,1.27)
KEY-SMD_4P-L6.0-W6.0-P3.90-LS10.0
  rect 1.8x1 smd: 1(-4.5,1.95) 2(4.5,1.95) 3(-4.5,-1.95) 4(4.5,-1.95)
LED-TH_BD5.0_RED
  round 1.651 hole 0.965: 1(0,1.27) 2(0,-1.27)
LM2596-ADJ模块
  rect 2.54x2.54 hole 0.914: 1(-19.748,8.826) 2(-19.752,-8.826) 3(19.752,8.826) 4(19.748,-8.826)
MPU6050-丝印不可移
  round 1.524 hole 0.914: 1(0,0) 2(0,-2.54) 3(0,-5.08) 4(0,-7.62) 5(0,-10.16) 6(0,-12.7) 7(0,-15.24) 8(0,-17.78)
OLED-TH_L27.8-W27.2-P2.54_C9900033791
  round 1.8 hole 1.05: 1(-3.81,0) 2(-1.27,0) 3(1.27,0) 4(3.81,0)
R0603
  rect 0.806x0.864 smd: 1(-0.753,0) 2(0.753,0)
R0805
  rect 1.133x1.377 smd: 1(-1,0) 2(1,0)
SW-TH_SS-12D10L5
  round 2.5 hole 1.8: 1(-4.7,0) 2(0,0) 3(4.7,0)

## Nets
3V3: CN12.1 CN12.3 CN12.5 CN12.7 J1.2 J5.2 J7.2 LED1.1 LED2.1 U3.3 循迹.2
5V: 5V.1 5V.2 C16.1 C17.1 CN1.5 CN2.5 CN8.1 CN11.1 CN11.3 CN11.5 CN11.7 MPU1.1 TB6612.2 TB6612.13 U32.31 U33.2 摄像头.4 无线串口.2 蓝牙.4 蜂鸣器.1
GND: C16.2 C17.2 CN1.2 CN2.2 CN8.4 CN12.2 CN12.4 CN12.6 CN12.8 DC1.2 DC1.3 H4.1 H4.2 H6.1 H6.2 J1.1 J5.1 J7.1 KEY2.3 KEY2.4 LED3.2 LED4.2 MPU1.2 R16.1 STM32F103RCT6最小系统板.30 STM32F103RCT6最小系统板.32 TB6612.3 TB6612.8 TB6612.9 U3.2 U3.4 U32.5 U32.6 U32.28 U32.30 U32.32 U33.1 循迹.1 摄像头.3 无线串口.1 蓝牙.3 蜂鸣器.3
VBAT_IN: CN11.2 CN11.4 CN11.6 CN11.8 H3.1 H3.2 R14.2 SW3.2 TB6612.1 U3.1
VCC: KEY1.3 KEY1.4 KEY3.3 KEY3.4 U32.2
6050_SCL: MPU1.3 U32.7
6050_SDA: MPU1.4 U32.8
ADC: R15.1 R16.2 STM32F103RCT6最小系统板.6
AIN1: TB6612.14 U32.21
AIN2: TB6612.15 U32.22
AO1: CN2.6 TB6612.4
AO2: CN2.1 TB6612.5
B0T0: U32.3
BEEP: STM32F103RCT6最小系统板.3 蜂鸣器.2
BIN1: TB6612.12 U32.20
BIN2: TB6612.11 U32.17
BO1: CN1.6 TB6612.7
BO2: CN1.1 TB6612.6
BOT1: U32.4
ENCODERA1: CN2.4 STM32F103RCT6最小系统板.10
ENCODERA2: CN2.3 STM32F103RCT6最小系统板.9
ENCODERB1: CN1.4 U32.9
ENCODERB2: CN1.3 U32.10
KEY1: KEY1.1 KEY1.2 U32.13
KEY2: KEY2.1 KEY2.2 U32.12
KEY3: KEY3.1 KEY3.2 STM32F103RCT6最小系统板.5
LED1: R10.1 STM32F103RCT6最小系统板.26
LED2: R11.1 STM32F103RCT6最小系统板.23
LED3: R12.1 STM32F103RCT6最小系统板.4
LED4: R13.1 STM32F103RCT6最小系统板.25
OLED_SCL: U32.16 U33.3
OLED_SDA: STM32F103RCT6最小系统板.24 U33.4
OUT1: STM32F103RCT6最小系统板.20 循迹.10
OUT2: STM32F103RCT6最小系统板.19 循迹.9
OUT3: STM32F103RCT6最小系统板.18 循迹.8
OUT4: STM32F103RCT6最小系统板.17 循迹.7
OUT5: U32.26 循迹.6
OUT6: U32.14 循迹.5
OUT7: STM32F103RCT6最小系统板.14 循迹.4
OUT8: STM32F103RCT6最小系统板.13 循迹.3
PA2: STM32F103RCT6最小系统板.12 蓝牙.1
PA3: STM32F103RCT6最小系统板.11 蓝牙.2
PA6: STM32F103RCT6最小系统板.16 TB6612.10
PA7: STM32F103RCT6最小系统板.15 TB6612.16
PA9: U32.23 摄像头.2
PA10: U32.24 摄像头.1
PA13: U32.19
PB4: U32.11
PB10: CN8.2 STM32F103RCT6最小系统板.22
PB11: CN8.3 STM32F103RCT6最小系统板.21
PC2: STM32F103RCT6最小系统板.8
PC3: STM32F103RCT6最小系统板.7
PC6: J7.3 STM32F103RCT6最小系统板.28
PC7: J1.3 STM32F103RCT6最小系统板.27
PC8: J5.3 U32.27
PC9: U32.25
PC10: U32.18 无线串口.3
PC11: U32.15 无线串口.4
PC13: STM32F103RCT6最小系统板.1
VB: STM32F103RCT6最小系统板.2
$1N2595: LED2.2 R11.2
$1N2596: LED1.2 R10.2
$1N2601: LED3.1 R12.2
$1N2602: LED4.1 R13.2
$1N3090: DC1.1 SW3.1
$1N6234: R14.1 R15.2

Pads without a net: MPU1 5 6 7 8; STM32F103RCT6最小系统板 29 31; SW3 3; U32 1 29

## Via types
v1: diameter 0.61, hole 0.305, Top Layer to Bottom Layer, 107 vias
v2: diameter 1.27, hole 0.635, Top Layer to Bottom Layer, 1 via

## Routing (per net, layer and track width the routed paths; a pad name or vN(x,y) marks a point on that pad's centre or on a via; arc(x,y) is an arc through that point)
3V3: length 157.7
  Top Layer w1.27: J5.2 J1.2 J7.2 16.22,41.67 16.2,41.66 ; U3.3 57.37,38.95 57.37,40.6 ; 16.2,41.66 11.1,41.66 10,42.76 v2(10,43.14) ; 16.2,41.66 33.96,41.66 ; 33.94,41.64 33.96,41.66 ; 33.96,41.66 56.57,41.66 57.37,40.86
  Bottom Layer w0.762: U3.3 57.75,39.2 59.65,39.2 60.41,38.44 60.41,16.49 ; CN12.1 CN12.3 CN12.5 CN12.7 60.26,16.34 60.41,16.49 ; 60.41,16.49 60.41,12.15 61.56,11.01 67.78,11.01 68.3,10.49 循迹.2
  Bottom Layer w1.27: 7.58,77.01 7.62,77.05 LED1.1 ; 7.58,77.01 7.58,72.35 10,69.94 10,43.27 ; 7.58,77.01 7.58,83.78 8.09,84.29 10.96,84.29 LED2.1
5V: length 439.6
  Top Layer w0.254: 94.96,46.61 94.88,46.7 79.21,46.7 78.96,46.44 78.96,44.93
  Top Layer w0.762: 蓝牙.4 5.17,68.8 4.79,68.42 4.79,57.29 CN8.1 ; 87.04,61.81 92.16,61.81 92.93,61.05 92.93,56.19 ; 92.93,56.19 93.09,56.35 U33.2 96.74,56.35 97.02,56.63 97.02,80.96 96.35,81.62 摄像头.4 ; 92.93,56.19 92.93,52.49 94.96,50.46 94.96,42.51 ; 9.61,14.06 9.61,8.22 10.5,7.33 27.78,7.33 28.92,8.47 28.92,31.84 30.06,32.98 48.85,32.98 ; TB6612.13 84.16,27.9 84.93,28.66 84.93,34.63 85.56,35.27 90.51,35.27 90.89,35.65 90.89,37.68 91.47,38.26 CN2.5 94.56,38.26 94.96,38.65 94.96,42.51 ; 61.18,32.86 61.18,10.88 62.32,9.74 87.08,9.74 88.23,10.88 88.23,19.77 88.74,20.28 C16.1 92.48,20.28 CN1.5 ; 94.96,42.51 69.81,42.51 68.41,41.11 68.41,34.12 67.27,32.98 TB6612.2 48.85,32.98 ; 48.85,32.98 48.86,32.97 MPU1.1
  Top Layer w1.27: 9.6,14.29 9.06,14.82 CN11.7 CN11.5 CN11.3 CN11.1
  Bottom Layer w0.762: U32.31 68.16,54.95 69.05,54.06 77.81,54.06 78.7,54.95 78.7,60.8 79.7,61.8 无线串口.2 ; CN8.1 4.36,56.86 2.25,56.86 0.68,55.29 0.68,33.15 1.87,31.97 20.03,31.97 21.42,30.57 21.42,15.96 20.16,14.69 10,14.69 9.6,14.29
GND:
  vias: v1(14.85,12.03) v1(14.85,11.27) v1(14.85,10.5) v1(15.56,12.03) v1(15.56,11.27) v1(15.56,10.5) v1(16.32,12.03) v1(16.32,11.27) v1(16.32,10.5) v1(19.39,12.03) v1(19.39,11.26) v1(19.39,10.49) v1(20.1,12.03) v1(20.1,11.26) v1(20.1,10.49) v1(20.86,12.03) v1(20.86,11.26) v1(20.86,10.49) v1(23.1,12.03) v1(23.1,11.27) v1(23.1,10.5) v1(23.81,12.03) v1(23.81,11.27) v1(23.81,10.5) v1(24.57,12.03) v1(24.57,11.27) v1(24.57,10.5) v1(28.63,39.22) v1(28.63,38.45) v1(28.63,37.68) v1(29.33,39.22) v1(29.33,38.45) v1(29.33,37.68) v1(30.03,27.91) v1(30.03,27.15) v1(30.03,26.37) v1(30.1,39.22) v1(30.1,38.45) v1(30.1,37.68) v1(30.73,27.91) v1(30.73,27.15) v1(30.73,26.37) v1(31.49,27.91) v1(31.49,27.15) v1(31.49,26.37) v1(33.17,39.21) v1(33.17,38.45) v1(33.17,37.67) v1(33.88,39.21) v1(33.88,38.45) v1(33.88,37.67) v1(34.64,39.21) v1(34.64,38.45) v1(34.64,37.67) v1(34.57,27.91) v1(34.57,27.14) v1(34.57,26.37) v1(35.28,27.91) v1(35.28,27.14) v1(35.28,26.37) v1(36.04,27.91) v1(36.04,27.14) v1(36.04,26.37) v1(36.88,39.22) v1(36.88,38.45) v1(36.88,37.68) v1(37.59,39.22) v1(37.59,38.45) v1(37.59,37.68) v1(38.28,27.91) v1(38.28,27.15) v1(38.28,26.37) v1(38.35,39.22) v1(38.35,38.45) v1(38.35,37.68) v1(38.99,27.91) v1(38.99,27.15) v1(38.99,26.37) v1(39.75,27.91) v1(39.75,27.15) v1(39.75,26.37) v1(44.41,91.4) v1(86.07,97.75) v1(93.94,99.4) v1(93.94,98.63) v1(95.59,93.05) v1(95.65,92.24) v1(96.03,90.13) v1(95.97,89.37) v1(96.47,93.05) v1(96.47,92.16) v1(96.86,90.13) v1(96.86,89.37)
VBAT_IN: length 211.4
  Top Layer w1.27: 22.01,35.52 TB6612.1 ; 22.01,35.52 17.36,35.52 ; 22.01,35.52 22.01,16.89 ; 17.36,35.52 15.58,33.74 3.81,33.74 2.63,34.93 2.63,46.27 3.9,47.54 7.53,47.54 7.96,47.97 7.96,50 8.6,50.64 37.3,50.64 38.32,51.65 R14.2 ; 17.36,35.52 17.93,36.09 U3.1 ; 6.65,19.14 6.65,16.98 ; 22.01,16.89 21.85,16.73 2.76,16.73 1.99,15.96 1.99,7.36 CN11.2 ; 22.01,16.89 25.96,16.89 27.27,15.58 27.27,14.41 27.52,14.16 27.52,12.13 27.27,11.87
VCC: length 35.4
  Top Layer w0.762: 79.16,95.1 76.21,98.05 U32.2 ; 79.16,95.1 KEY1.3 KEY1.4 ; 79.16,95.1 79.16,93 79.69,92.46 90.69,92.46 KEY3.3
6050_SCL: length 124.5
  Top Layer w0.254: U32.7 69.39,91.66 72.61,91.66 73.11,91.15 73.11,87.47 72.22,86.58 43.78,86.58 43.4,86.19 v1(43.4,48.73)
  Bottom Layer w0.254: v1(43.4,48.73) 43.4,47.97 43.01,47.59 36.79,47.59 36.28,47.08 36.28,30.57 37.05,29.81 43.01,29.81 43.78,29.04 MPU1.3
6050_SDA: length 117.3
  Top Layer w0.254: v1(42.51,48.73) 42.51,88.35 43.27,89.12 71.72,89.12 71.97,89.37 71.97,90.13 71.67,90.43 U32.8
  Bottom Layer w0.254: MPU1.4 41.24,28.54 40.98,28.79 36.28,28.79 35.72,29.35 35.72,47.41 36.28,47.97 42.25,47.97 42.51,48.22 v1(42.51,48.73)
ADC: length 13
  Top Layer w0.762: STM32F103RCT6最小系统板.6 38.27,92.97 R16.2 R15.1
AIN1: length 64.4
  Bottom Layer w0.254: TB6612.14 75.91,30.44 75.15,31.2 75.15,49.62 74.51,50.25 63.34,50.25 63.08,50.51 63.08,72.22 63.34,72.48 67.99,72.48 U32.21
AIN2: length 62.4
  Bottom Layer w0.254: TB6612.15 76.8,32.98 76.42,33.36 76.42,50.64 75.65,51.4 64.35,51.4 63.84,51.91 63.84,70.7 64.48,71.34 70.45,71.34 70.7,71.59 70.7,72.45
AO1: length 38.3
  Top Layer w0.762: CN2.6 71.74,40.76 70.7,39.71 70.7,28.66 69.94,27.9 TB6612.4
AO2: length 48.5
  Top Layer w0.762: CN2.1 92.67,26.89 92.04,26.25 84.91,26.25 84.29,25.63 84.29,15.71 83.27,14.69 74.76,14.69 73.88,15.58 73.88,24.6 73.11,25.36 TB6612.5
BEEP: length 107.9
  Top Layer w0.254: 蜂鸣器.2 81.75,44.16 81.37,43.78 41.11,43.78 40.22,44.67 40.22,93.56 39.71,94.07 26.42,94.07 24.98,95.51
BIN1: length 75.6
  Bottom Layer w0.254: TB6612.12 74.76,25.36 74.38,25.74 74.38,48.22 73.5,49.11 62.7,49.11 62.45,49.36 62.45,73.75 62.7,74 70.45,74 70.7,74.26 70.7,75.01
BIN2: length 80.5
  Bottom Layer w0.254: TB6612.11 74.38,22.82 73.5,23.71 73.5,47.46 73.11,47.84 61.3,47.84 60.92,48.22 60.92,75.78 62.7,77.56 67.99,77.56 U32.17
BO1: length 44.4
  Top Layer w0.762: CN1.6 92.65,22.95 87.47,22.95 86.7,22.19 86.7,12.92 85.43,11.65 72.61,11.65 71.46,12.79 71.46,19.9 71.08,20.28 TB6612.7
BO2: length 64.2
  Top Layer w0.762: TB6612.6 71.84,22.82 72.61,22.06 72.61,14.57 73.88,13.3 84.16,13.3 85.43,14.57 85.43,23.84 86.07,24.47 86.32,24.47 86.7,24.85 94.7,24.85 95.47,24.09 95.47,11.24 94.7,10.48 CN1.1
ENCODERA1: length 191.5
  Top Layer w0.254: CN2.4 97.99,35.76 98.54,36.31 98.54,85.79 98.26,86.07 94.07,86.07 93.43,86.7 93.43,95.97 92.65,96.76 79.1,96.76 76.64,99.22 8.28,99.22 7.84,98.77 7.84,87.21 8.47,86.58 21.17,86.58 21.42,86.83 21.42,88.61 21.8,88.99 26.42,88.99 STM32F103RCT6最小系统板.10
ENCODERA2: length 192.6
  Top Layer w0.254: 24.98,87.89 22.91,85.81 7.96,85.81 7.33,86.45 7.33,99.02 7.88,99.57 76.79,99.57 79.25,97.12 92.8,97.12 93.81,96.1 93.81,87.08 94.45,86.45 98.39,86.45 98.9,85.94 98.9,34 98.13,33.24 92.69,33.24 CN2.3
ENCODERB1: length 103.9
  Bottom Layer w0.254: U32.9 68.16,86.83 68.56,86.43 97.5,86.43 97.75,86.17 97.75,18.5 97.24,18 92.69,18 CN1.4
ENCODERB2: length 105.8
  Bottom Layer w0.254: U32.10 97.58,87.89 98.64,86.83 98.64,15.71 98.13,15.2 92.95,15.2 CN1.3
KEY1: length 58.9
  Top Layer w0.254: v1(92.8,97.88) 92.8,98.77 92.56,99 KEY1.2 KEY1.1
  Bottom Layer w0.254: v1(92.8,97.88) 92.8,92.16 92.29,91.66 64.86,91.66 63.97,90.77 63.97,83.66 64.99,82.64 67.99,82.64 U32.13
KEY2: length 20.2
  Top Layer w0.254: 89.99,83.57 89.82,83.4 79.97,83.4 78.02,85.35 U32.12
KEY3: length 72.3
  Top Layer w0.254: KEY3.1 90.69,88.56 76.33,88.56 75.91,88.99 75.91,93.43 75.02,94.32 v1(43.01,94.32)
  Bottom Layer w0.254: v1(43.01,94.32) 25.11,94.32 24.85,94.07 24.85,93.1 24.98,92.97
LED1: length 18.9
  Top Layer w0.254: v1(17.08,70.57) 17.08,76.4 R10.1
  Bottom Layer w0.254: v1(17.08,70.57) 17.08,69.08 17.49,68.67 26.63,68.67 27.52,67.78 STM32F103RCT6最小系统板.26
LED2: length 20.6
  Top Layer w0.254: v1(18.63,73.66) 18.63,82.77 17.82,83.57 R11.1
  Bottom Layer w0.254: 24.98,70.11 19.6,70.11 18.63,71.08 v1(18.63,73.66)
LED3: length 17.8
  Top Layer w0.254: STM32F103RCT6最小系统板.4 27.52,96.35 27.27,96.61 23.33,96.61 22.69,95.97 22.69,90.26 22.23,89.8 R12.1
LED4: length 42.5
  Top Layer w0.254: R13.1 16.83,94.17 15.58,92.93 13.42,92.93 13.24,92.75 v1(13.24,91.78)
  Bottom Layer w0.254: v1(13.24,91.78) 13.24,67.96 13.93,67.27 24.68,67.27 24.98,67.57
OLED_SCL: length 45.6
  Bottom Layer w0.254: U33.3 92.16,58.89 91.66,59.4 91.66,79.72 91.02,80.35 70.78,80.35 U32.16
OLED_SDA: length 100.9
  Top Layer w0.254: STM32F103RCT6最小系统板.24 27.56,70.07 33.11,70.07 33.87,70.83 v1(33.87,75.4)
  Bottom Layer w0.254: v1(33.87,75.4) 33.87,80.1 35.27,81.5 91.1,81.5 91.28,81.68 91.28,82.51 91.57,82.81 95.59,82.81 95.85,82.56 95.85,61.8 U33.4
OUT1: length 135.5
  Bottom Layer w0.254: 循迹.10 88.3,3.34 87.72,2.76 50.51,2.76 50.05,3.22 50.05,15.63 46.85,15.63 45.35,17.14 45.35,66.59 44.67,67.27 31.59,67.27 31.57,67.28 29.79,67.28 28.92,68.16 28.92,74.89 28.62,75.19 STM32F103RCT6最小系统板.20
OUT2: length 137
  Bottom Layer w0.254: 循迹.9 85.8,3.89 85.05,3.14 50.89,3.14 50.4,3.62 50.4,15.99 47,15.99 45.71,17.28 45.71,67.25 45.31,67.64 30.07,67.64 29.4,68.31 29.4,75.94 28.92,76.42 25.62,76.42 25.36,76.16 25.36,75.57 24.98,75.19
OUT3: length 132.2
  Bottom Layer w0.254: STM32F103RCT6最小系统板.18 27.56,77.69 29.43,77.69 29.75,77.36 29.75,68.46 30.22,68 45.72,68 46.06,67.65 46.06,17.43 47.15,16.34 50.76,16.34 50.76,3.9 51.17,3.49 52.31,3.52 82.77,3.52 83.3,4.05 循迹.8
OUT4: length 133.8
  Bottom Layer w0.254: 循迹.7 80.8,4.35 80.35,3.9 51.52,3.9 51.12,4.31 51.12,16.7 47.3,16.7 46.42,17.58 46.42,67.94 46,68.35 30.5,68.35 30.11,68.75 30.11,78.4 29.68,78.83 25.23,78.83 24.98,78.58 24.85,78.58 24.85,77.86 24.98,77.73
OUT5: length 86.9
  Bottom Layer w0.254: 循迹.6 78.3,9.09 78.96,9.74 87.59,9.74 89.12,11.26 89.12,65.88 87.42,67.57 U32.26
OUT6: length 107.9
  Top Layer w0.254: v1(75.4,82.77) 76.54,81.62 v1(76.54,76.16)
  Bottom Layer w0.254: U32.14 70.74,82.77 v1(75.4,82.77) ; v1(76.54,76.16) 76.54,68.54 77.05,68.03 88.23,68.03 89.75,66.51 89.75,10.63 88.48,9.36 80.1,9.36 79.59,8.85 79.59,6.82 78.7,5.93 76.16,5.93 75.78,6.31 75.78,7.57 循迹.5
OUT7: length 123.9
  Bottom Layer w0.254: 循迹.4 73.3,5.86 72.61,5.17 52.41,5.17 52.18,5.4 52.18,17.46 51.88,17.77 47.74,17.77 47.49,18.02 47.49,68.77 46.84,69.42 31.6,69.42 31.2,69.81 31.2,82 30.44,82.77 27.56,82.77 STM32F103RCT6最小系统板.14
OUT8: length 124.2
  Bottom Layer w0.254: 24.98,82.81 26.08,83.91 31.2,83.91 32.22,82.89 32.22,70.57 32.73,70.07 47.33,70.07 48.09,69.3 48.09,18.63 48.6,18.12 52.03,18.12 52.54,17.61 52.54,5.93 52.92,5.55 70.19,5.55 70.83,6.19 70.83,7.57 循迹.3
PA2: length 44.7
  Top Layer w0.254: STM32F103RCT6最小系统板.12 27.52,84.29 27.27,84.04 20.92,84.04 20.28,83.4 20.28,61.43 20.03,61.18 蓝牙.1
PA3: length 39.2
  Top Layer w0.254: 6.31,64.1 19.01,64.1 19.27,64.35 19.27,84.29 20.33,85.35 24.98,85.35
PA6: length 112.1
  Top Layer w0.254: v1(35.78,80.1) 27.69,80.1 STM32F103RCT6最小系统板.16
  Bottom Layer w0.254: v1(35.78,80.1) 59.14,80.1 60.29,78.96 60.29,47.46 60.67,47.08 71.72,47.08 72.35,46.44 72.35,20.92 72.99,20.28 TB6612.10
PA7: length 141.7
  Top Layer w0.254: v1(35.78,78.96) 26.3,78.96 24.98,80.27
  Bottom Layer w0.254: v1(35.78,78.96) 58.64,78.96 59.53,78.07 59.53,46.83 60.16,46.19 71.08,46.19 71.46,45.81 71.46,16.73 71.72,16.47 83.27,16.47 84.04,17.23 84.04,34.89 83.4,35.52 TB6612.16
PA9: length 58.6
  Top Layer w0.254: U32.23 67.57,70.11 67.02,69.56 67.02,57.75 67.53,57.24 82.64,57.24 83.27,57.87 83.27,67.27 84.04,68.03 90.39,68.03 91.02,68.67 91.02,76.03 91.53,76.54 摄像头.2
PA10: length 63.4
  Top Layer w0.254: 摄像头.1 92.54,74 91.78,73.24 91.78,68.03 90.89,67.14 84.8,67.14 84.04,66.38 84.04,57.11 83.4,56.48 66.89,56.48 66.51,56.86 66.51,70.83 67.02,71.34 70.63,71.34 70.83,71.14 70.83,70.11
PB10: length 42.6
  Top Layer w0.254: CN8.2 20.84,54.62 21.3,55.08 21.3,73.37 21.81,73.88 27.27,73.88 27.52,73.62 STM32F103RCT6最小系统板.22
PB11: length 40.3
  Top Layer w0.254: CN8.3 21.86,52.08 22.44,52.67 22.44,72.22 22.87,72.65 24.98,72.65
PC6: length 41.3
  Bottom Layer w0.254: STM32F103RCT6最小系统板.28 27.82,64.73 29.43,64.73 29.68,64.48 29.68,51.4 29.43,51.14 12.53,51.14 12.03,50.64 12.03,44.16 12.28,43.9 13.32,43.9
PC7: length 46.6
  Bottom Layer w0.254: J1.3 12.7,46.28 12.41,46.57 12.41,50.38 12.81,50.79 30.85,50.79 31.33,51.27 31.33,65.75 30.82,66.26 25.23,66.26 24.98,66 24.98,65.03
PC8: length 69.4
  Top Layer w0.254: v1(44.41,64.86) v1(64.6,64.86)
  Bottom Layer w0.254: v1(44.41,64.86) 33.24,64.86 32.35,63.97 32.35,51.02 31.71,50.38 13.93,50.38 13.68,50.13 J5.3 ; U32.27 67.99,64.86 v1(64.6,64.86)
PC10: length 51.7
  Top Layer w0.254: 86.67,59.27 85.18,59.27 84.93,59.02 84.93,56.48 84.42,55.97 66.38,55.97 66.13,56.22 66.13,78.7 66.38,78.96 70.57,78.96 70.83,78.7 70.83,77.93
PC11: length 49.7
  Top Layer w0.254: U32.15 66.05,80.27 65.62,79.84 65.62,55.72 66.13,55.21 86.7,55.21 86.92,55.43 无线串口.4
$1N2595: length 5.9
  Top Layer w0.254: R11.2 15.46,83.44 15.46,82.39 14.87,81.8 LED2.2
$1N2596: length 6.2
  Top Layer w0.254: LED1.2 14.82,74.51 15.33,75.02 15.33,76.65 R10.2
$1N2601: length 5.9
  Top Layer w0.254: R12.2 15.32,88.47 14.82,87.97 11.09,87.97 LED3.1
$1N2602: length 5.7
  Top Layer w0.254: LED4.1 10.7,94.4 14.9,94.4 15.08,94.58 15.08,95.35 R13.2
$1N3090: length 27.4
  Top Layer w1.27: 14.14,27.46 14.19,27.51 14.19,30.8 13.15,31.84 2.76,31.84 1.82,30.9 1.82,20.03
$1N6234: length 2.2
  Top Layer w0.762: R15.2 R14.1

## Copper pours and planes (outline as drawn; the poured copper is in the pictures)
3V3 on Bottom Layer: 56.84,17.62 60.16,17.62 60.16,7.46 56.84,7.46
5V on Top Layer: 3.77,15.58 10.76,15.58 10.76,5.8 3.77,5.8
GND on Top Layer: -19.34,117.44 112.1,117.44 112.1,-12.87 -19.34,-12.87
GND on Bottom Layer: -16.93,120.36 116.17,120.36 116.17,-10.32 -16.93,-10.32
VBAT_IN on Top Layer: 0.34,21.55 9.49,21.55 9.49,5.8 0.34,5.8
$1N3090 on Top Layer: 0.47,32.53 15.62,32.53 15.62,18.76 0.47,18.76

Small or netless copper shapes (teardrops, artwork), in the pictures only: 126 on Top Layer, 75 on Bottom Layer

## Text on the board
Top Silkscreen Layer: GND | 5V | 3V3 | OUT+ | OUT- | IN+ | IN- | PC14 | PC15 | ON/OFF | VIN | ADC | PA5 | PA4 | PB3 | PA8 | PC5 | PC4 | PB1 | PB0 | ENB2 | ENB1 | BO1 | BO2 | ENA1 | ENA2 | AO2 | AO1 | RX | TX | PC8 | PC6 | PC7 | PB15 | PB13 | PB11 | PA3 | PC13 | PA7 | PC1 | PC3 | PA1 | PB14 | PB12 | PB10 | PC0 | PA2 | PC2 | PA0 | PA6 | VB | B0T0 | PA13 | PA11 | PD2 | PA15 | PA9 | PC9 | PB6 | PC11 | PB8 | PB4 | PC12 | PB5 | B0T1 | PB9 | PB7 | PC10 | PA14 | PA12 | PA10 | MotorA | MotorB | OLED | SDA | SCL | 注意方向 | 串口屏 | 舵机 | 第九届雏鹰计划 / 学习板
